# EAGLE design EthCtrlMeter (EAGLE 9.6.2)
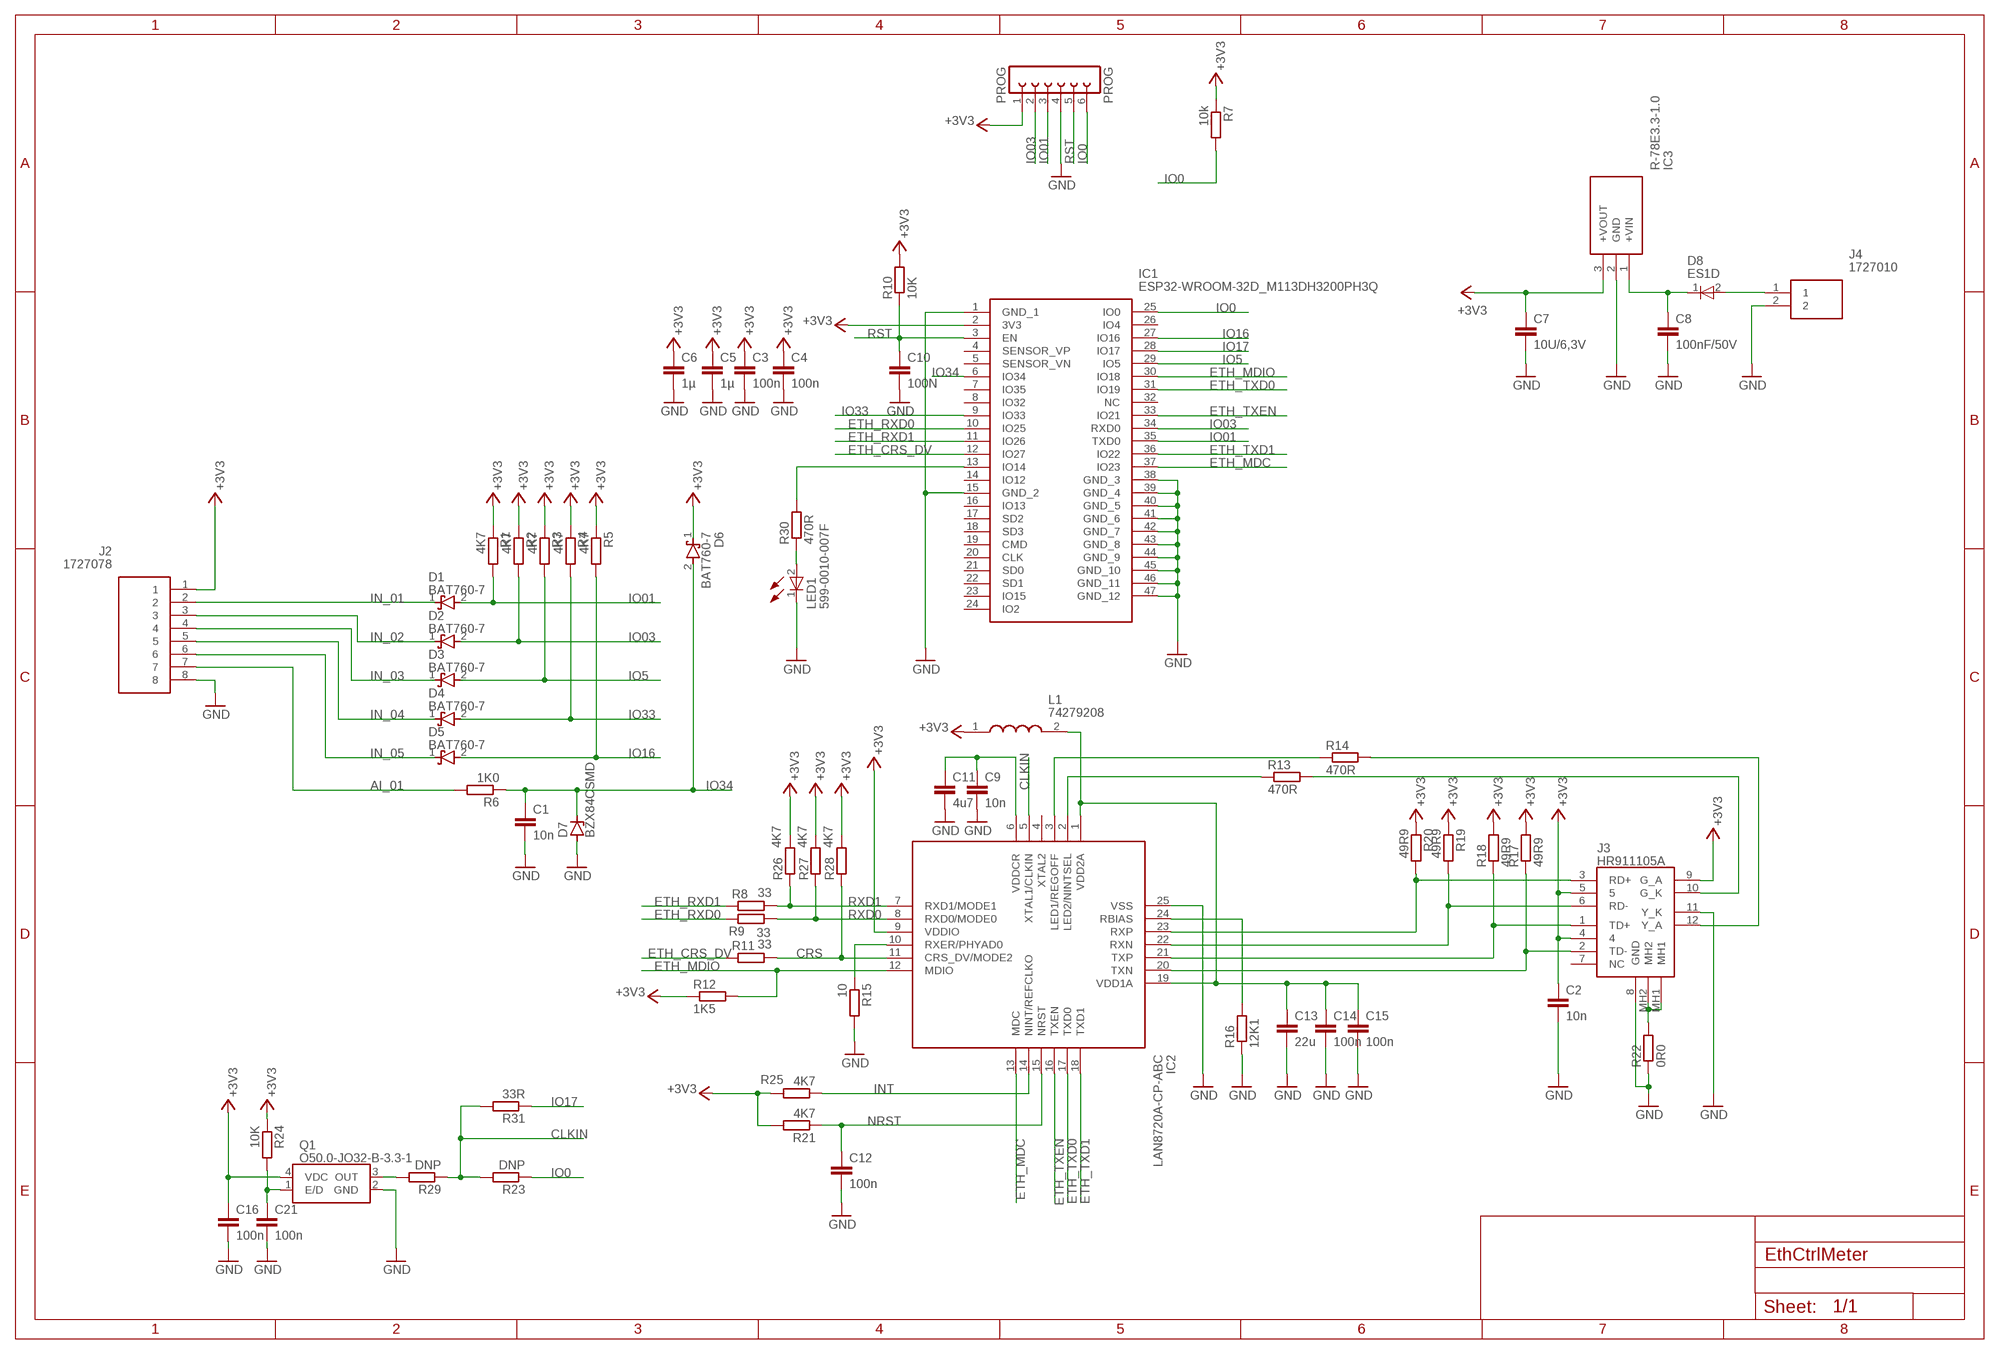
[diagram p0: schematic, sheet 1]

## Parts
C1  10n  C-EUC0603  [C0603]
C2  10n  C-EUC0603  [C0603]
C3  100n  C-EUC0603  [C0603]
C4  100n  C-EUC0603  [C0603]
C5  1µ  C-EUC0603  [C0603]
C6  1µ  C-EUC0603  [C0603]
C7  10U/6,3V  C-EUC0603  [C0603]
C8  100nF/50V  C-EUC0603  [C0603]
C9  10n  C-EUC0603  [C0603]
C10  100N  C-EUC0603  [C0603]
C11  4u7  C-EUC0603  [C0603]
C12  100n  C-EUC0603  [C0603]
C13  22u  C-EUC0603  [C0603]
C14  100n  C-EUC0603  [C0603]
C15  100n  C-EUC0603  [C0603]
C16  100n  C-EUC0603  [C0603]
C21  100n  C-EUC0603  [C0603]
D1  BAT760-7  [SOD2513X120N]
D2  BAT760-7  [SOD2513X120N]
D3  BAT760-7  [SOD2513X120N]
D4  BAT760-7  [SOD2513X120N]
D5  BAT760-7  [SOD2513X120N]
D6  BAT760-7  [SOD2513X120N]
D7  BZX84CSMD  [TO236]
D8  ES1D  ES1DL_R3G  [SODFL3618X143N]
IC1  ESP32-WROOM-32D_M113DH3200PH3Q  [ESP32WROOM32DM113DH3200PH3Q0]
IC2  LAN8720A-CP-ABC  [QFN50P400X400X100-25N]
IC3  R-78E3.3-1.0  [R78E3310]
J2  1727078  [1727078]
J3  HR911105A  [HR911105A]
J4  1727010  [1727010]
L1  74279208  [CAPC2012X90N]
LED1  599-0010-007F  [LEDM168X70N]
PROG  PROG  FE06-1  [FE06]
Q1  O50.0-JO32-B-3.3-1  [O200JO32B1V31T1LF]
R1  4K7  R-EU_R0603  [R0603]
R2  4K7  R-EU_R0603  [R0603]
R3  4K7  R-EU_R0603  [R0603]
R4  4K7  R-EU_R0603  [R0603]
R5  4K7  R-EU_R0603  [R0603]
R6  1K0  R-EU_R0603  [R0603]
R7  10k  R-EU_R0603  [R0603]
R8  33  R-EU_R0603  [R0603]
R9  33  R-EU_R0603  [R0603]
R10  10K  R-EU_R0603  [R0603]
R11  33  R-EU_R0603  [R0603]
R12  1K5  R-EU_R0603  [R0603]
R13  470R  R-EU_R0603  [R0603]
R14  470R  R-EU_R0603  [R0603]
R15  10  R-EU_R0603  [R0603]
R16  12K1  R-EU_R0603  [R0603]
R17  49R9  R-EU_R0603  [R0603]
R18  49R9  R-EU_R0603  [R0603]
R19  49R9  R-EU_R0603  [R0603]
R20  49R9  R-EU_R0603  [R0603]
R21  4K7  R-EU_R0603  [R0603]
R22  0R0  R-EU_R0603  [R0603]
R23  DNP  R-EU_R0603  [R0603]
R24  10K  R-EU_R0603  [R0603]
R25  4K7  R-EU_R0603  [R0603]
R26  4K7  R-EU_R0603  [R0603]
R27  4K7  R-EU_R0603  [R0603]
R28  4K7  R-EU_R0603  [R0603]
R29  DNP  R-EU_R0603  [R0603]
R30  470R  R-EU_R0603  [R0603]
R31  33R  R-EU_R0603  [R0603]

## Nets
+3V3: C2.1 C3.1 C4.1 C5.1 C6.1 C7.1 C16.1 D6.1(K) IC1.2(3V3) IC2.9(VDDIO) IC3.3(+VOUT) J2.1 J3.4 J3.5 J3.9(G_A) L1.1 PROG.1 Q1.4(VDC) R1.1 R2.1 R3.1 R4.1 R5.1 R7.1 R10.2 R12.1 R17.2 R18.2 R19.1 R20.1 R21.2 R24.1 R25.2 R26.2 R27.2 R28.2
AI_01: J2.7 R6.2
CLKIN: IC2.5(XTAL1/CLKIN) R23.2 R29.1 R31.2
CRS: IC2.11(CRS_DV/MODE2) R11.2 R28.1
ETH_CRS_DV: IC1.12(IO27) R11.1
ETH_MDC: IC1.37(IO23) IC2.13(MDC)
ETH_MDIO: IC1.30(IO18) IC2.12(MDIO) R12.2
ETH_PHY_PWR: C21.1 Q1.1(E/D) R24.2
ETH_RXD0: IC1.10(IO25) R9.1
ETH_RXD1: IC1.11(IO26) R8.1
ETH_TXD0: IC1.31(IO19) IC2.17(TXD0)
ETH_TXD1: IC1.36(IO22) IC2.18(TXD1)
ETH_TXEN: IC1.33(IO21) IC2.16(TXEN)
GND: C1.2 C2.2 C3.2 C4.2 C5.2 C6.2 C7.2 C8.2 C9.2 C10.2 C11.2 C12.2 C13.2 C14.2 C15.2 C16.2 C21.2 D7.A IC1.1(GND_1) IC1.15(GND_2) IC1.38(GND_3) IC1.39(GND_4) IC1.40(GND_5) IC1.41(GND_6) IC1.42(GND_7) IC1.43(GND_8) IC1.44(GND_9) IC1.45(GND_10) IC1.46(GND_11) IC1.47(GND_12) IC2.25(VSS) IC3.2(GND) J2.8 J3.8(GND) J3.11(Y_K) J4.2 LED1.1(K) PROG.4 Q1.2(GND) R15.2 R16.1 R22.1
IN_01: D1.1(K) J2.2
IN_02: D2.1(K) J2.3
IN_03: D3.1(K) J2.4
IN_04: D4.1(K) J2.5
IN_05: D5.1(K) J2.6
INT: IC2.14(NINT/REFCLKO) R25.1
IO0: IC1.25(IO0) PROG.6 R7.2 R23.1
IO01: D1.2(A) IC1.35(TXD0) PROG.3 R1.2
IO03: D2.2(A) IC1.34(RXD0) PROG.2 R2.2
IO5: D3.2(A) IC1.29(IO5) R3.2
IO16: D5.2(A) IC1.27(IO16) R5.2
IO17: IC1.28(IO17) R31.1
IO33: D4.2(A) IC1.9(IO33) R4.2
IO34: C1.1 D6.2(A) D7.C IC1.6(IO34) R6.1
N$1: IC1.13(IO14) R30.2
N$2: IC2.20(TXN) J3.2(TD-) R17.1
N$3: IC2.22(RXN) J3.6(RD-) R19.2
N$4: IC2.23(RXP) J3.3(RD+) R20.2
N$5: J3.12(Y_A) R14.2
N$6: J3.10(G_K) R13.2
N$7: C8.1 D8.1(K) IC3.1(+VIN)
N$8: Q1.3(OUT) R29.2
N$9: J3.MH1 J3.MH2 R22.2
N$10: D8.2(A) J4.1
N$11: LED1.2(A) R30.1
N$18: C13.1 C14.1 C15.1 IC2.1(VDD2A) IC2.19(VDD1A) L1.2
N$19: C9.1 C11.1 IC2.6(VDDCR)
N$20: IC2.2(LED2/NINTSEL) R13.1
N$21: IC2.3(LED1/REGOFF) R14.1
N$22: IC2.10(RXER/PHYAD0) R15.1
N$23: IC2.21(TXP) J3.1(TD+) R18.1
N$24: IC2.24(RBIAS) R16.2
NRST: C12.1 IC2.15(NRST) R21.1
RST: C10.1 IC1.3(EN) PROG.5 R10.1
RXD0: IC2.8(RXD0/MODE0) R9.2 R27.1
RXD1: IC2.7(RXD1/MODE1) R8.2 R26.1
Unconnected: IC1.4(SENSOR_VP) IC1.5(SENSOR_VN) IC1.7(IO35) IC1.8(IO32) IC1.14(IO12) IC1.16(IO13) IC1.17(SD2) IC1.18(SD3) IC1.19(CMD) IC1.20(CLK) IC1.21(SD0) IC1.22(SD1) IC1.23(IO15) IC1.24(IO2) IC1.26(IO4) IC1.32(NC) IC2.4(XTAL2) J3.7(NC)

## Library data of the parts
C1-C16 C21 = rcl:C-EU: CAPACITOR, European symbol; SPICEPREFIX: C
D1-D6 = SamacSys_Parts:BAT760-7: Diode Schottky 30V 1A 2Pin SOD323 Diodes Inc BAT760-7, SMT Schottky Diode, 30V 1A, 2-Pin SOD-323 Source: Datasheet <https://www.diodes.com/assets/Datasheets/ds30498.pdf>; ARROW_PART_NUMBER: BAT760-7; ARROW_PRICE-STOCK: https://www.arrow.com/en/products/bat760-7/diodes-incorporated; DESCRIPTION: Diode Schottky 30V 1A 2Pin SOD323 Diodes Inc BAT760-7, SMT Schottky Diode, 30V 1A, 2-Pin SOD-323; HEIGHT: 1.2mm; MANUFACTURER_NAME: Diodes Inc.; MANUFACTURER_PART_NUMBER: BAT760-7; MOUSER_PART_NUMBER: 621-BAT760-7; MOUSER_PRICE-STOCK: https://www.mouser.co.uk/ProductDetail/Diodes-Incorporated/BAT760-7?qs=JV7lzlMm3yKDDyO09xoRbQ%3D%3D
D7 = diode:BZX84CSMD: Z DIODE
D8 = SamacSys_Parts:ES1DL_R3G: TAIWAN SEMICONDUCTOR - ES1DL R3G - DIODE, ULTRA-FAST SMF 1A 200V Source: Datasheet <https://mouser.componentsearchengine.com/Datasheets/2/ES1DL R3G.pdf>; ARROW_PART_NUMBER: ES1DL R3G; ARROW_PRICE-STOCK: https://www.arrow.com/en/products/es1dlr3g/taiwan-semiconductor?region=nac; DESCRIPTION: TAIWAN SEMICONDUCTOR - ES1DL R3G - DIODE, ULTRA-FAST SMF 1A 200V; HEIGHT: 1.43mm; MANUFACTURER_NAME: Taiwan Semiconductor; MANUFACTURER_PART_NUMBER: ES1DL R3G; MOUSER_PART_NUMBER: 821-ES1DLR3G; MOUSER_PRICE-STOCK: https://www.mouser.co.uk/ProductDetail/Taiwan-Semiconductor/ES1DL-R3G?qs=70cth9uAySeVkK%252BhDJIsVg%3D%3D
IC1 = SamacSys_Parts:ESP32-WROOM-32D_M113DH3200PH3Q: WiFi Modules (802.11) SMD Module, ESP32-D0WD, 32Mbits SPI flash, UART mode, PCB antenna Source: Datasheet <https://www.mouser.in/datasheet/2/891/esp32-wroom-32d_esp32-wroom-32u_datasheet_en-1365844.pdf>; DESCRIPTION: WiFi Modules (802.11) SMD Module, ESP32-D0WD, 32Mbits SPI flash, UART mode, PCB antenna; HEIGHT: 3.2mm; MANUFACTURER_NAME: Espressif Systems; MANUFACTURER_PART_NUMBER: ESP32-WROOM-32D(M113DH3200PH3Q0); MOUSER_PART_NUMBER: 356-ESP32WROOM-32D; MOUSER_PRICE-STOCK: https://www.mouser.co.uk/ProductDetail/Espressif-Systems/ESP32-WROOM-32DM113DH3200PH3Q0?qs=W%2FMpXkg%252BdQ5YcAmhj3kVpA%3D%3D
IC2 = SamacSys_Parts:LAN8720A-CP-ABC: Ethernet ICs Small Footprint RMII RMII 10/100 Ethernet Source: Datasheet <http://ww1.microchip.com/downloads/en/DeviceDoc/00002165B.pdf>; ARROW_PART_NUMBER: LAN8720A-CP-ABC; ARROW_PRICE-STOCK: https://www.arrow.com/en/products/lan8720a-cp-abc/microchip-technology?region=nac; DESCRIPTION: Ethernet ICs Small Footprint RMII RMII 10/100 Ethernet; HEIGHT: 1mm; MANUFACTURER_NAME: Microchip; MANUFACTURER_PART_NUMBER: LAN8720A-CP-ABC; MOUSER_PART_NUMBER: 579-LAN8720ACPABC; MOUSER_PRICE-STOCK: https://www.mouser.co.uk/ProductDetail/Microchip-Technology/LAN8720A-CP-ABC?qs=Gd3Cm49KlLPCUEGQe1b4LA%3D%3D
IC3 = SamacSys_Parts:R-78E3.3-1.0: Recom DC-DC Switching Regulator, 7 28V dc Input, 3.3V Output, 1A Source: Datasheet <https://componentsearchengine.com/Datasheets/1/R-78E3.3-1.0.pdf>; ARROW_PART_NUMBER: R-78E3.3-1.0; ARROW_PRICE-STOCK: https://www.arrow.com/en/products/r-78e3.3-1.0/recom-power; DESCRIPTION: Recom DC-DC Switching Regulator, 7 28V dc Input, 3.3V Output, 1A; HEIGHT: 10.9mm; MANUFACTURER_NAME: RECOM Power; MANUFACTURER_PART_NUMBER: R-78E3.3-1.0; MOUSER_PART_NUMBER: 919-R-78E3.3-1.0; MOUSER_PRICE-STOCK: https://www.mouser.co.uk/ProductDetail/RECOM-Power/R-78E33-10/?qs=D0iH%252BVFiYPOgLjjtWWnV0Q%3D%3D
J2 = SamacSys_Parts:1727078: Fixed Terminal Blocks 8P 3.81mm 90DEG Source: Datasheet <https://componentsearchengine.com/Datasheets/2/1727078.pdf>; ARROW_PART_NUMBER: 1727078; ARROW_PRICE-STOCK: https://www.arrow.com/en/products/1727078/phoenix-contact; DESCRIPTION: Fixed Terminal Blocks 8P 3.81mm 90DEG; HEIGHT: 8.65mm; MANUFACTURER_NAME: Phoenix Contact; MANUFACTURER_PART_NUMBER: 1727078; MOUSER_PART_NUMBER: 651-1727078; MOUSER_PRICE-STOCK: https://www.mouser.co.uk/ProductDetail/Phoenix-Contact/1727078/?qs=JcjeNNoqGSNsjTv9gJgF1A%3D%3D
J3 = SamacSys_Parts:HR911105A: Ethernet Connectors/Modular Connectors (RJ45 RJ11) DIP RoHS Source: Datasheet <https://datasheet.lcsc.com/szlcsc/Zhongshan-HanRun-Elec-HR911105A_C12074.pdf>; DESCRIPTION: Ethernet Connectors/Modular Connectors (RJ45 RJ11) DIP RoHS; HEIGHT: 13.75mm; MANUFACTURER_NAME: Hanrun Electronics; MANUFACTURER_PART_NUMBER: HR911105A
J4 = SamacSys_Parts:1727010: Conn PC Terminal Block 2 POS 3.81mm Solder ST Thru-Hole 13.5A Source: Datasheet <https://datasheet.datasheetarchive.com/originals/distributors/SFDatasheet-2/sf-00050638.pdf>; ARROW_PART_NUMBER: 1727010; ARROW_PRICE-STOCK: https://www.arrow.com/en/products/1727010/phoenix-contact?region=nac; DESCRIPTION: Conn PC Terminal Block 2 POS 3.81mm Solder ST Thru-Hole 13.5A; HEIGHT: 8.65mm; MANUFACTURER_NAME: Phoenix Contact; MANUFACTURER_PART_NUMBER: 1727010; MOUSER_PART_NUMBER: 651-1727010; MOUSER_PRICE-STOCK: https://www.mouser.co.uk/ProductDetail/Phoenix-Contact/1727010?qs=JcjeNNoqGSMjtHhQoBJ7UA%3D%3D
L1 = SamacSys_Parts:74279208: SMD EMI Suppression Ferrite Beads WE-CBF Source: Datasheet; DESCRIPTION: SMD EMI Suppression Ferrite Beads WE-CBF; HEIGHT: 0.9mm; MANUFACTURER_NAME: Wurth Elektronik; MANUFACTURER_PART_NUMBER: 74279208; MOUSER_PART_NUMBER: 710-74279208; MOUSER_PRICE-STOCK: https://www.mouser.co.uk/ProductDetail/Wurth-Elektronik/74279208?qs=2kOmHSv6VfSoTnc9ejLZaA%3D%3D
LED1 = SamacSys_Parts:599-0010-007F: Standard LEDs - SMD SMD 0603 RED Source: Datasheet <https://www.mouser.com/datasheet/2/109/Dialight_CBI_data_599-0603_Apr2018-1370611.pdf>; DESCRIPTION: Standard LEDs - SMD SMD 0603 RED; HEIGHT: 0.7mm; MANUFACTURER_NAME: Dialight; MANUFACTURER_PART_NUMBER: 599-0010-007F; MOUSER_PART_NUMBER: 645-599-0010-007F; MOUSER_PRICE-STOCK: https://www.mouser.co.uk/ProductDetail/Dialight/599-0010-007F?qs=gTYE2QTfZfTcdWv2Knd4aQ%3D%3D
PROG = con-lsta:FE06-1: FEMALE HEADER; OC_FARNELL: unknown; OC_NEWARK: unknown
Q1 = SamacSys_Parts:O50.0-JO32-B-3.3-1
R1-R31 = rcl:R-EU_: RESISTOR, European symbol; SPICEPREFIX: R

## Board
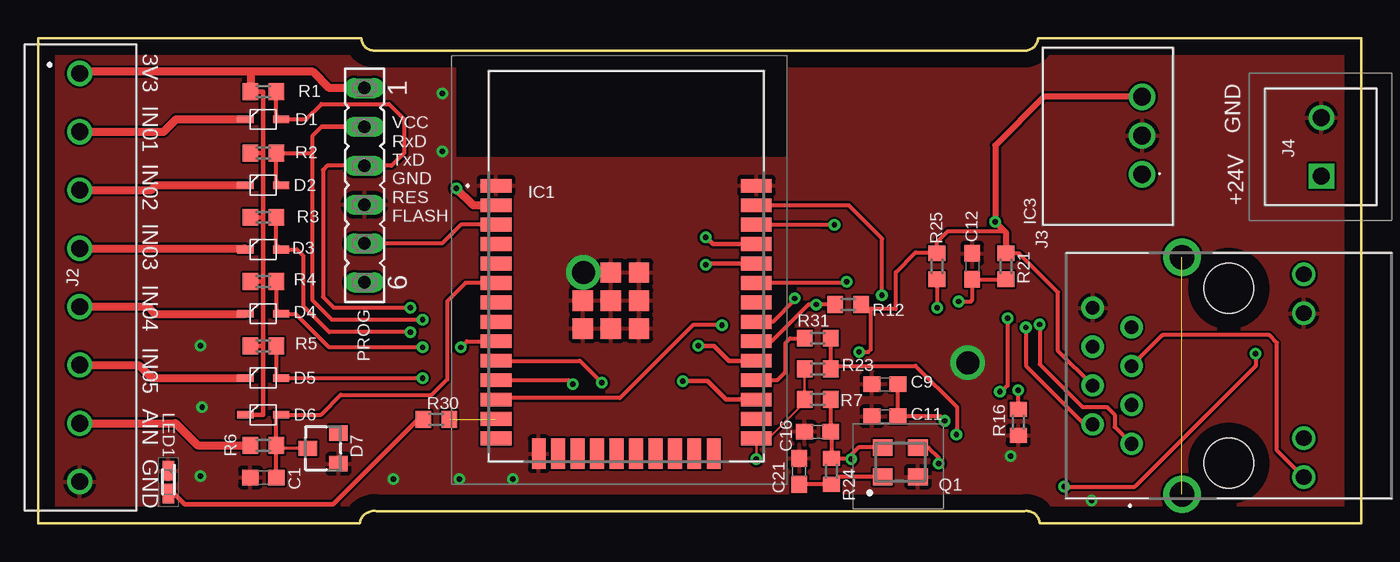
[diagram p1: board, top side]
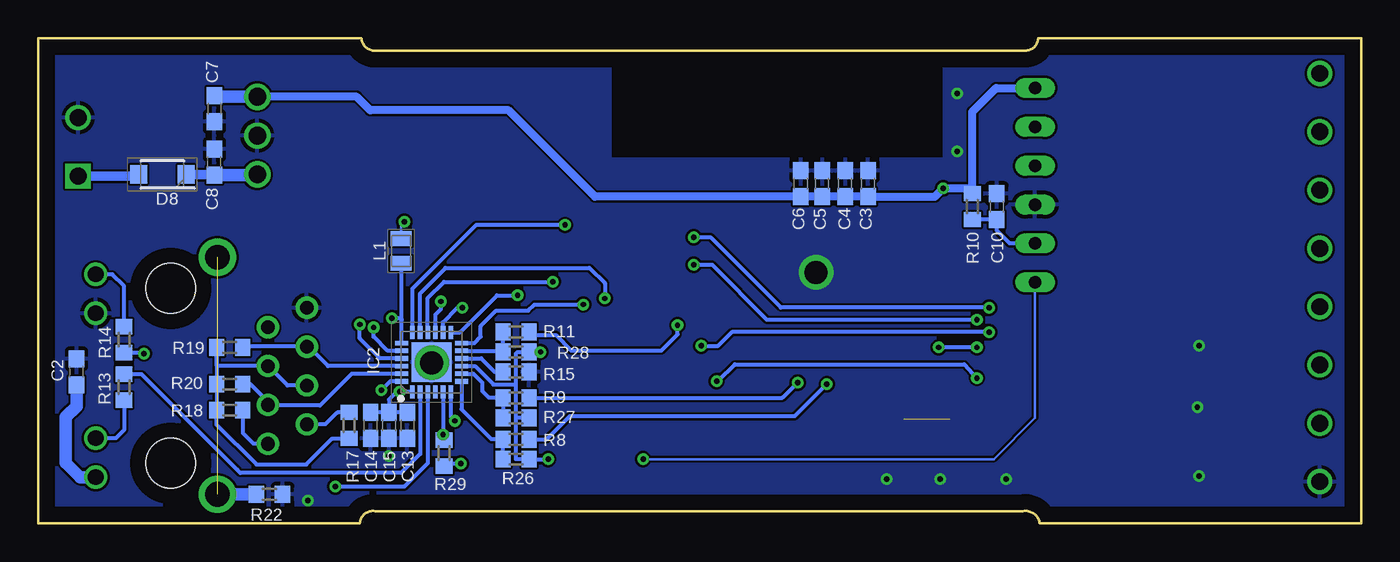
[diagram p2: board, bottom side, seen from below]

Size 86.4 x 31.7 mm. Coordinates in mm from the lower left corner, seen from the top.
Outline: 21.1,31.7 0,31.7 0,0 21,0 21.01,0.05 arc-90 22.1,0.8 64.3,0.8 64.42,0.8 arc-95 65.4,0 86.4,0 86.4,31.7 65.3,31.7 65.3,31.66 arc-90 64.3,30.9 22.1,30.9 21.96,30.89 arc-90 21.1,31.7
Copper layers (1*16): Top 0.035mm / dielectric 1.5mm / Bottom 0.035mm
Design rules "default": minimum track width 6mil, minimum drill 0.35mm, track to track 6mil, track to pad 6mil, pad to pad 6mil, via to via 6mil, smd to smd 6mil, copper to edge 40mil, drill to drill 6mil, minimum pad ring 10mil, minimum via ring 8mil, stop-mask expansion 4mil, vias tented up to drill 0mil, thermal gap 10mil
Holes 3.25 mm at 77.75,3.93 77.75,15.36
tKeepout: area 9.4,0 to 11.8,31.7; area 74.5,0 to 76.9,31.7

### Footprints (pad centres in the part's own frame; a part is rotated, then mirrored left to right if it is on the bottom)
C0603 = smd 1.1 x 1: 1 -0.85,0; 2 0.85,0
SOD2513X120N = smd 1.075 x 0.5: 1 -1.162,0; 2 1.162,0
TO236 = smd 1 x 1.2: A -1,-1; C 0,1; NC 1,-1
SODFL3618X143N = smd 1.12 x 1.22: 1 -1.55,0; 2 1.55,0
ESP32WROOM32DM113DH3200PH3Q0 = smd 2 x 0.9: 1 -8.5,5.26; 2 -8.5,3.99; 3 -8.5,2.72; 4 -8.5,1.45; 5 -8.5,0.18; 6 -8.5,-1.09; 7 -8.5,-2.36; 8 -8.5,-3.63; 9 -8.5,-4.9; 10 -8.5,-6.17; 11 -8.5,-7.44; 12 -8.5,-8.71; 13 -8.5,-9.98; 14 -8.5,-11.25; 25 8.5,-11.25; 26 8.5,-9.98; 27 8.5,-8.71; 28 8.5,-7.44; 29 8.5,-6.17; 30 8.5,-4.9; 31 8.5,-3.63; 32 8.5,-2.36; 33 8.5,-1.09; 34 8.5,0.18; 35 8.5,1.45; 36 8.5,2.72; 37 8.5,3.99; 38 8.5,5.26 | smd 0.9 x 2: 15 -5.715,-12.25; 16 -4.445,-12.25; 17 -3.175,-12.25; 18 -1.905,-12.25; 19 -0.635,-12.25; 20 0.635,-12.25; 21 1.905,-12.25; 22 3.175,-12.25; 23 4.445,-12.25; 24 5.715,-12.25 | smd 1.33 x 1.33: 39 -2.835,-0.405; 40 -2.835,-2.24; 41 -2.835,-4.075; 42 -1,-4.075; 43 0.835,-4.075; 44 0.835,-2.24; 45 0.835,-0.405; 46 -1,-0.405; 47 -1,-2.24
QFN50P400X400X100-25N = smd 0.85 x 0.3: 1 -1.95,1.25; 2 -1.95,0.75; 3 -1.95,0.25; 4 -1.95,-0.25; 5 -1.95,-0.75; 6 -1.95,-1.25; 13 1.95,-1.25; 14 1.95,-0.75; 15 1.95,-0.25; 16 1.95,0.25; 17 1.95,0.75; 18 1.95,1.25 | smd 0.3 x 0.85: 7 -1.25,-1.95; 8 -0.75,-1.95; 9 -0.25,-1.95; 10 0.25,-1.95; 11 0.75,-1.95; 12 1.25,-1.95; 19 1.25,1.95; 20 0.75,1.95; 21 0.25,1.95; 22 -0.25,1.95; 23 -0.75,1.95; 24 -1.25,1.95 | smd 2.6 x 2.6: 25 0,0
R78E3310 = drill 1.15 pad 1.725: 1 0,0; 2 2.54,0; 3 5.08,0
1727078 = drill 1.1 pad 1.65: 1 0,0; 2 3.81,0; 3 7.62,0; 4 11.43,0; 5 15.24,0; 6 19.05,0; 7 22.86,0; 8 26.67,0
HR911105A = drill 0.89 pad 1.446: 1 0,0; 2 -1.27,-2.54; 3 -2.54,0; 4 -3.81,-2.54; 5 -5.08,0; 6 -6.35,-2.54; 7 -7.62,0; 8 -8.89,-2.54 | drill 1.02 pad 1.53: 9 2.18,11.25; 10 -0.36,11.25; 11 -8.53,11.25; 12 -11.07,11.25 | drill 1.63 pad 2.445: MH1 3.3,3.3; MH2 -12.19,3.3 | hole 3.25: 1.27,6.35; -10.16,6.35
1727010 = drill 1.1 pad 1.65 square: 1 0,0 | drill 1.1 pad 1.65: 2 3.81,0
CAPC2012X90N = smd 0.96 x 1.39: 1 -0.81,0; 2 0.81,0
LEDM168X70N = smd 1.25 x 0.75: 1 -0.75,0; 2 0.75,0
FE06 = drill 0.813 long: 1 -6.35,0; 2 -3.81,0; 3 -1.27,0; 4 1.27,0; 5 3.81,0; 6 6.35,0
O200JO32B1V31T1LF = smd 1.3 x 1.1: 1 -1.15,-0.95; 2 1.15,-0.95; 3 1.15,0.95; 4 -1.15,0.95
R0603 = smd 1 x 1.1: 1 -0.85,0; 2 0.85,0

### Placement (x,y rotation side)
C1  14.7,3 180 top
C2  83.9,9.9 90 bottom
C3  32.2,22.2 90 bottom
C4  33.7,22.2 90 bottom
C5  35.2,22.2 90 bottom
C6  36.6,22.2 90 bottom
C7  74.9,27.1 270 bottom
C8  74.9,23.6 90 bottom
C9  55.3,9.1 180 top
C10  23.8,20.7 90 bottom
C11  55.3,7 180 top
C12  61,16.8 90 top
C13  62.3,6.4 270 bottom
C14  64.7,6.4 270 bottom
C15  63.5,6.4 270 bottom
C16  50.9,6 180 top
C21  49.7,3.4 90 top
D1  14.7,26.4 0 top
D2  14.7,22.1 0 top
D3  14.7,17.9 0 top
D4  14.7,13.7 0 top
D5  14.7,9.5 0 top
D6  14.7,7.1 0 top
D7  18.6,4.9 90 top
D8  78.3,22.8 180 bottom
IC1  38.4,16.8 0 top
IC2  60.71,10.53 90 bottom
IC3  72.1,22.8 90 top
J2  2.7,29.4 270 top
J3  71.4,5.2 270 top
J4  83.8,22.7 90 top
L1  62.7,17.8 270 bottom
LED1  8.5,2.7 270 top
PROG  21.3,22.1 270 top
Q1  56.3,4 0 top
R1  14.7,28.2 0 top
R2  14.7,24.2 0 top
R3  14.7,20 0 top
R4  14.7,15.8 0 top
R5  14.7,11.6 0 top
R6  14.7,5.1 180 top
R7  50.9,8.1 180 top
R8  55.2,5.5 180 bottom
R9  55.2,8.2 180 bottom
R10  25.4,20.7 90 bottom
R11  55.2,12.5 180 bottom
R12  52.9,14.3 180 top
R13  80.8,8.9 270 bottom
R14  80.8,12 90 bottom
R15  55.2,9.9 0 bottom
R16  64,6.6 90 top
R17  66.1,6.4 270 bottom
R18  73.9,7.4 180 bottom
R19  73.9,11.5 0 bottom
R20  73.9,9.1 0 bottom
R21  63.2,16.8 90 top
R22  71.3,1.9 180 bottom
R23  50.9,10.1 0 top
R24  51.8,3.4 270 top
R25  58.7,16.8 90 top
R26  55.2,4.2 0 bottom
R27  55.2,6.9 0 bottom
R28  55.2,11.2 0 bottom
R29  59.9,4.6 270 bottom
R30  26,6.8 0 top
R31  50.9,12.1 0 top

### Tracks (layer width: path | path; a pad name or v marks a point on that pad's centre or on a via)
+3V3  (via drill 0.35)
  Top 0.254: R1.1 13.9,28.25 | 2.8,29.5 J2.1 | Q1.4 55.1,5 53.6,5 53.1,4.5 v53.1,4.2 53.05,4.25 R24.1 51.8,5.95 C16.1 R7.1 | 54.35,14 56,14 56,16.4 57.3,17.7 58.65,17.7 R25.2 58.7,18.4 59.4,19.1 63.2,19.1 R21.2 64.05,17.65 66.6,15.1 66.6,11.27 J3.4 | R12.1 54.05,14 54.35,14 | 54.35,14 54.35,11.35 54.2,11.2 v53.6,11.2 | J3.9 80.9,4.77 80.9,11.8 80.4,12.3 73.42,12.3 J3.5
  Top 0.305: R3.1 14.7,20 | 14.7,20 14.7,15.8 | 14.7,15.8 R4.1 | 14.7,15.8 14.7,11.6 | R5.1 14.7,11.6 | 14.7,20 14.7,24.2 | 14.7,24.2 R2.1 | R1.1 14.7,28.2 14.7,24.2 | 14.7,11.6 14.7,7.1 D6.1
  Top 0.406: IC3.3 65.68,27.88 62.5,24.7 v62.5,19.7 63.2,19 R21.2
  Top 0.508: 13.9,28.25 13.9,29.5 | 13.9,29.5 2.8,29.5 | IC1.2 28.4,20.79 v27.3,21.89 v27.3,21.9 | PROG.1 19,28.45 17.95,29.5 13.9,29.5
  Bottom 0.152: L1.1 62.7,19.5 v62.5,19.7
  Bottom 0.254: 55.2,9.1 55.23,9.07 56.67,9.07 57.87,10.28 IC2.9 | 55.2,9.1 55.2,11.1 55.1,11.2 R28.2 v53.6,11.2 | 55.2,6.9 55.2,4.2 R26.2 v53.1,4.2 | 55.2,6.9 55.2,9.1 | R27.2 55.2,6.9 | J3.4 70.13,9.01 J3.5 74.68,10.28 74.75,10.35 R19.1 R20.1 R18.2 74.75,6.45 72.15,3.85 68.9,3.85 67.2,5.55 R17.2
  Bottom 0.508: IC3.3 65.6,27.88 64.72,27 55.7,27 50.05,21.35 C6.1 C5.1 C4.1 C3.1 27.85,21.35 v27.3,21.9 25.4,21.9 R10.2 25.4,26.9 23.85,28.45 PROG.1
  Bottom 0.813: C7.1 74.83,27.88 IC3.3 | C2.1 83.9,7.65 84.6,6.95 84.6,3.97 83.65,3.02 J3.9
AI_01
  Top 0.508: R6.2 10.4,5.1 8.96,6.54 J2.7
CLKIN  (via drill 0.35)
  Top 0.254: R31.2 R23.2 51.95,10.3 57.3,10.3 60,7.6 60,5.8 v59.96,5.8
  Bottom 0.254: IC2.5 v59.96,5.8 59.96,5.51 R29.1
CRS
  Bottom 0.254: R11.2 R28.1 56.13,11.28 IC2.11
ETH_CRS_DV  (via drill 0.35)
  Top 0.254: IC1.12 30,8.19 37.99,8.19 42.75,12.95 v44.65,12.95
  Bottom 0.254: v44.65,12.95 44.65,12.35 45.7,11.3 51.6,11.3 52.6,12.3 54.15,12.3 R11.1
ETH_MDC  (via drill 0.35)
  Top 0.254: IC1.37 52.91,20.79 55.1,18.6 v55.1,14.9
  Bottom 0.254: IC2.13 58.86,12.48 56.44,14.9 v55.1,14.9
ETH_MDIO  (via drill 0.35)
  Top 0.254: IC1.30 47.9,11.9 50.3,14.3 v50.8,14.3 R12.2
  Bottom 0.254: v50.8,14.3 54,14.3 54.4,13.9 56.5,13.9 57.5,12.9 57.5,12.2 57.92,11.78 IC2.12
ETH_PHY_PWR
  Top 0.254: Q1.1 52.3,3.05 R24.2 C21.1
ETH_RXD0  (via drill 0.35)
  Top 0.254: IC1.10 35.37,10.63 v36.8,9.2
  Bottom 0.254: v36.8,9.2 37.8,8.2 R9.1
ETH_RXD1  (via drill 0.35)
  Top 0.254: IC1.11 34.64,9.36 v34.9,9.1
  Bottom 0.254: v34.9,9.1 37,7 51.7,7 53.2,5.5 R8.1
ETH_TXD0  (via drill 0.35)
  Top 0.254: v49.4,14.7 49.4,14.6 47.97,13.17 IC1.31
  Bottom 0.254: IC2.17 61.46,15.04 59.8,16.7 50.4,16.7 49.4,15.7 v49.4,14.7
ETH_TXD1  (via drill 0.35)
  Top 0.254: IC1.36 51.18,19.52 51.2,19.5 v52,19.5
  Bottom 0.254: IC2.18 61.96,15.34 57.8,19.5 v52,19.5
ETH_TXEN  (via drill 0.35)
  Top 0.254: v52.8,15.8 52.71,15.71 IC1.33
  Bottom 0.254: IC2.16 60.96,14.74 59.91,15.79 52.81,15.79 v52.8,15.8
GND  (via drill 0.35, 1.5)
  other vias: 26.4,28.1 26.4,24.3 60.7,10.5 63.5,4.4 68.8,1.5 10.6,3.1 10.7,7.6 10.6,11.6 23.2,2.9 27.5,2.9 31,2.9 35.6,16.4
  pour Bottom: 0.1,32.4 0.1,0 86.4,0 86.4,32.8 49.1,32.8 49.1,23.8 27.2,23.8 27.2,32.4
  pour Top: 0.1,32.5 0.1,0 86.4,0 86.4,32.8 49.1,32.8 49.1,23.8 27.2,23.8 27.2,32.5
IN_01
  Top 0.508: J2.2 8.19,25.59 9,26.4 D1.1
IN_02
  Top 0.508: J2.3 7.38,21.78 7.7,22.1 D2.1
IN_03
  Top 0.152: 13.47,17.97 D3.1
  Top 0.508: J2.4 13.47,17.97
IN_04
  Top 0.508: J2.5 7.14,14.16 7.6,13.7 D4.1
IN_05
  Top 0.508: J2.6 6.55,10.35 7.4,9.5 D5.1
INT  (via drill 0.35)
  Top 0.254: R25.1 v58.7,14.1
  Bottom 0.254: IC2.14 59.96,13.14 59,14.1 v58.7,14.1
IO0  (via drill 0.35)
  Top 0.152: R23.1 R7.2 50.05,7.9 47.7,5.55 IC1.25 v46.9,4.2
  Bottom 0.152: PROG.6 21.3,6.9 24,4.2 v46.9,4.2
IO01  (via drill 0.35)
  Top 0.152: D1.2 15.55,26.71
  Top 0.254: 15.55,26.71 R1.2 | D1.2 17.5,26.4 18.5,27.4 22.9,27.4 23.9,26.4 23.9,24.2 23.07,23.37 PROG.3 18.87,23.37 18.6,23.1 18.6,14.8 19.3,14.1 v24.3,14.1
  Top 0.305: IC1.35 44.05,18.25 v43.6,18.7
  Bottom 0.254: v24.3,14.1 37.9,14.1 42.5,18.7 v43.6,18.7
IO03  (via drill 0.35)
  Top 0.254: D2.2 15.55,22.41 R2.2 17.9,24.2 | 18.51,25.91 17.9,25.3 17.9,24.2 | 17.9,24.2 17.9,14.6 19.2,13.3 v25.1,13.3
  Top 0.305: 18.51,25.91 PROG.2 | IC1.34 43.68,16.98 v43.6,16.9
  Bottom 0.254: v25.1,13.3 38.8,13.3 42.4,16.9 v43.6,16.9
IO5  (via drill 0.35)
  Top 0.254: R3.2 15.55,18.21 D3.2 16.9,17.9 17.3,17.5 17.3,14.2 19,12.5 v24.3,12.5
  Top 0.305: IC1.29 45.1,10.63 44.13,11.6 v43.1,11.6
  Bottom 0.254: v24.3,12.5 41.1,12.5 42,11.6 v43.1,11.6
IO16  (via drill 0.35)
  Top 0.254: R5.2 15.55,9.51 15.56,9.5 D5.2 | D5.2 15.66,9.5 15.56,9.6 | D5.2 v25.1,9.5
  Top 0.305: IC1.27 44.9,8.09 43.69,9.3 v42.1,9.3
  Bottom 0.254: v25.1,9.5 25.12,9.5 25.92,10.4 40.9,10.4 42,9.3 v42.1,9.3
IO17
  Top 0.254: IC1.28 48.26,9.36 48.8,9.9 48.8,11.8 49.1,12.1 R31.1
IO33  (via drill 0.35)
  Top 0.254: R4.2 15.55,14.01 D4.2 16.8,13.7 19,11.5 v25.1,11.5 | v27.6,11.5 28,11.9 IC1.9
  Bottom 0.254: v25.1,11.5 v27.6,11.5
IO34
  Top 0.2: D7.C 15.75,4.9 R6.1
  Top 0.254: C1.1 R6.1 15.55,7.1 D6.2 18.46,7.1 19.76,8.4 25.7,8.4 26.7,9.4 26.7,14.51 27.9,15.71 IC1.6
N$1  (1 unrouted)
  Top 0.305: IC1.13 29.88,6.8
N$2  (via drill 0.35)
  Top 0.254: v64.5,12.8 64.5,10.3 68.3,6.5 68.83,6.5 J3.2
  Bottom 0.254: IC2.20 63.58,11.28 64.5,12.2 v64.5,12.8 | R17.1 66.88,7.25 67.66,6.47 J3.2
N$3
  Bottom 0.254: IC2.22 67.48,10.28 68.75,11.55 J3.6 73,11.55 R19.2
N$4
  Bottom 0.254: IC2.23 65.92,9.78 68,7.7 71.36,7.7 J3.3 71.4,7.95 72.55,9.1 R20.2
N$5
  Bottom 0.254: R14.2 80.8,15.5 81.57,16.27 J3.12
N$6
  Bottom 0.254: R13.2 80.8,6.1 81.34,5.56 J3.10
N$7
  Bottom 0.61: D8.1 74.95,22.8 C8.1
  Bottom 0.813: IC3.1 72.15,22.75 C8.1
N$8  (via drill 0.35)
  Top 0.254: Q1.3 58.15,4.95 58.8,4.3 v58.8,3.9
  Bottom 0.254: v58.8,3.9 59.75,3.9 R29.2
N$9  (1 unrouted)
  Bottom 0.813: R22.2 J3.MH1
N$10
  Bottom 0.61: J4.1 79.95,22.7 D8.2
N$11
  Top 0.305: LED1.2 8.85,1.95 9.55,1.25 19.25,1.25 24.8,6.8 R30.1
N$18  (via drill 0.35)
  Top 0.254: v63.3,13.4 63.3,9 62.8,8.5 v62.8,8.6
  Bottom 0.254: IC2.1 62.48,8.58 62.5,8.6 v62.8,8.6 | v62.8,8.6 63,8.6 63.5,8.1 C15.1 | C13.1 C15.1 | C15.1 C14.1 | IC2.19 62.66,13.3 | 62.66,13.3 62.66,16.95 L1.2 | 62.66,13.3 62.76,13.4 v63.3,13.4 | v62.8,8.6
N$19  (via drill 0.35)
  Top 0.254: v59.2,6.7 58.9,7 C11.1 C9.1
  Bottom 0.254: IC2.6 59.46,6.96 v59.2,6.7
N$20
  Bottom 0.254: IC2.2 61.46,4.54 62.7,3.3 73.2,3.3 73.4,3.5 73.7,3.8 79.66,9.75 R13.1
N$21  (via drill 0.35)
  Top 0.254: v79.5,11.1 79.5,10.29 71.61,2.4 v67,2.4
  Bottom 0.254: IC2.3 60.96,3.94 62.5,2.4 v67,2.4 | v79.5,11.1 79.55,11.15 R14.1
N$22
  Bottom 0.254: IC2.10 57.48,10.78 56.6,9.9 R15.1
N$23  (via drill 0.35)
  Top 0.254: v65.41,13 65.41,10.39 68.2,7.6 69.8,7.6 70.3,7.1 70.3,6.3 J3.1
  Bottom 0.254: IC2.21 64.08,10.78 65.4,12.1 v65.4,13 v65.41,13 | R18.1 73.05,5.9 72.35,5.2 J3.1
N$24  (via drill 0.35)
  Top 0.254: R16.2 v64,8.7
  Bottom 0.254: IC2.24 63.42,9.28 v64,8.7
NRST  (via drill 0.35)
  Top 0.254: v60.1,14.5 60.9,14.5 61,14.6 C12.1 R21.1
  Bottom 0.254: IC2.15 60.46,13.64 60.1,14 v60.1,14.5
RST
  Top 0.254: IC1.3 27.6,19.52 26.37,18.29 PROG.5
  Bottom 0.254: PROG.5 22.94,18.29 23.8,19.15 C10.1 R10.1
RXD0
  Bottom 0.254: R27.1 R9.2 56.95,8.2 57.4,8.65 57.4,9.2 57.98,9.78 IC2.8
RXD1
  Bottom 0.254: R26.1 R8.2 56.8,5.5 58.76,7.46 IC2.7

### Text on the board
tNames: 3V3 | IN01 | GND | IN02 | +24V | IN03 | VCC / RxD / TxD / GND / RES / FLASH | IN04 | IN05 | AIN | GND